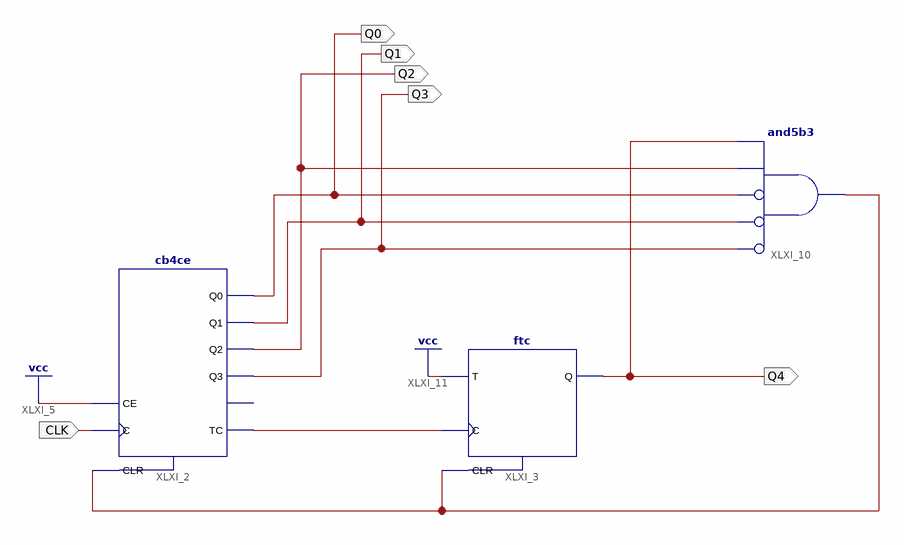
[diagram p0: schematic sheet 1]
// Xilinx ISE schematic Counter0_20.sch (spartan6) as structural Verilog: 3 symbols, 6 ports
module Counter0_20 (
  input  CLK,
  output Q4,
  output Q3,
  output Q1,
  output Q2,
  output Q0
);

  wire XLXN_4, XLXN_26;

  cb4ce XLXI_2 (.C(CLK), .CE(1'b1), .CLR(XLXN_26), .Q0(Q0), .Q1(Q1), .Q2(Q2), .Q3(Q3), .TC(XLXN_4));  // open: CEO
  ftc XLXI_3 (.C(XLXN_4), .CLR(XLXN_26), .T(1'b1), .Q(Q4));
  and XLXI_10 (XLXN_26, ~Q3, ~Q1, ~Q0, Q2, Q4);  // and5b3
endmodule
